# EasyEDA schematic Prática-04.json
TITLE: Sheet_1; REV: 1.0; Date: 2020-09-09; Sheet: 1/1; Company: Your Company
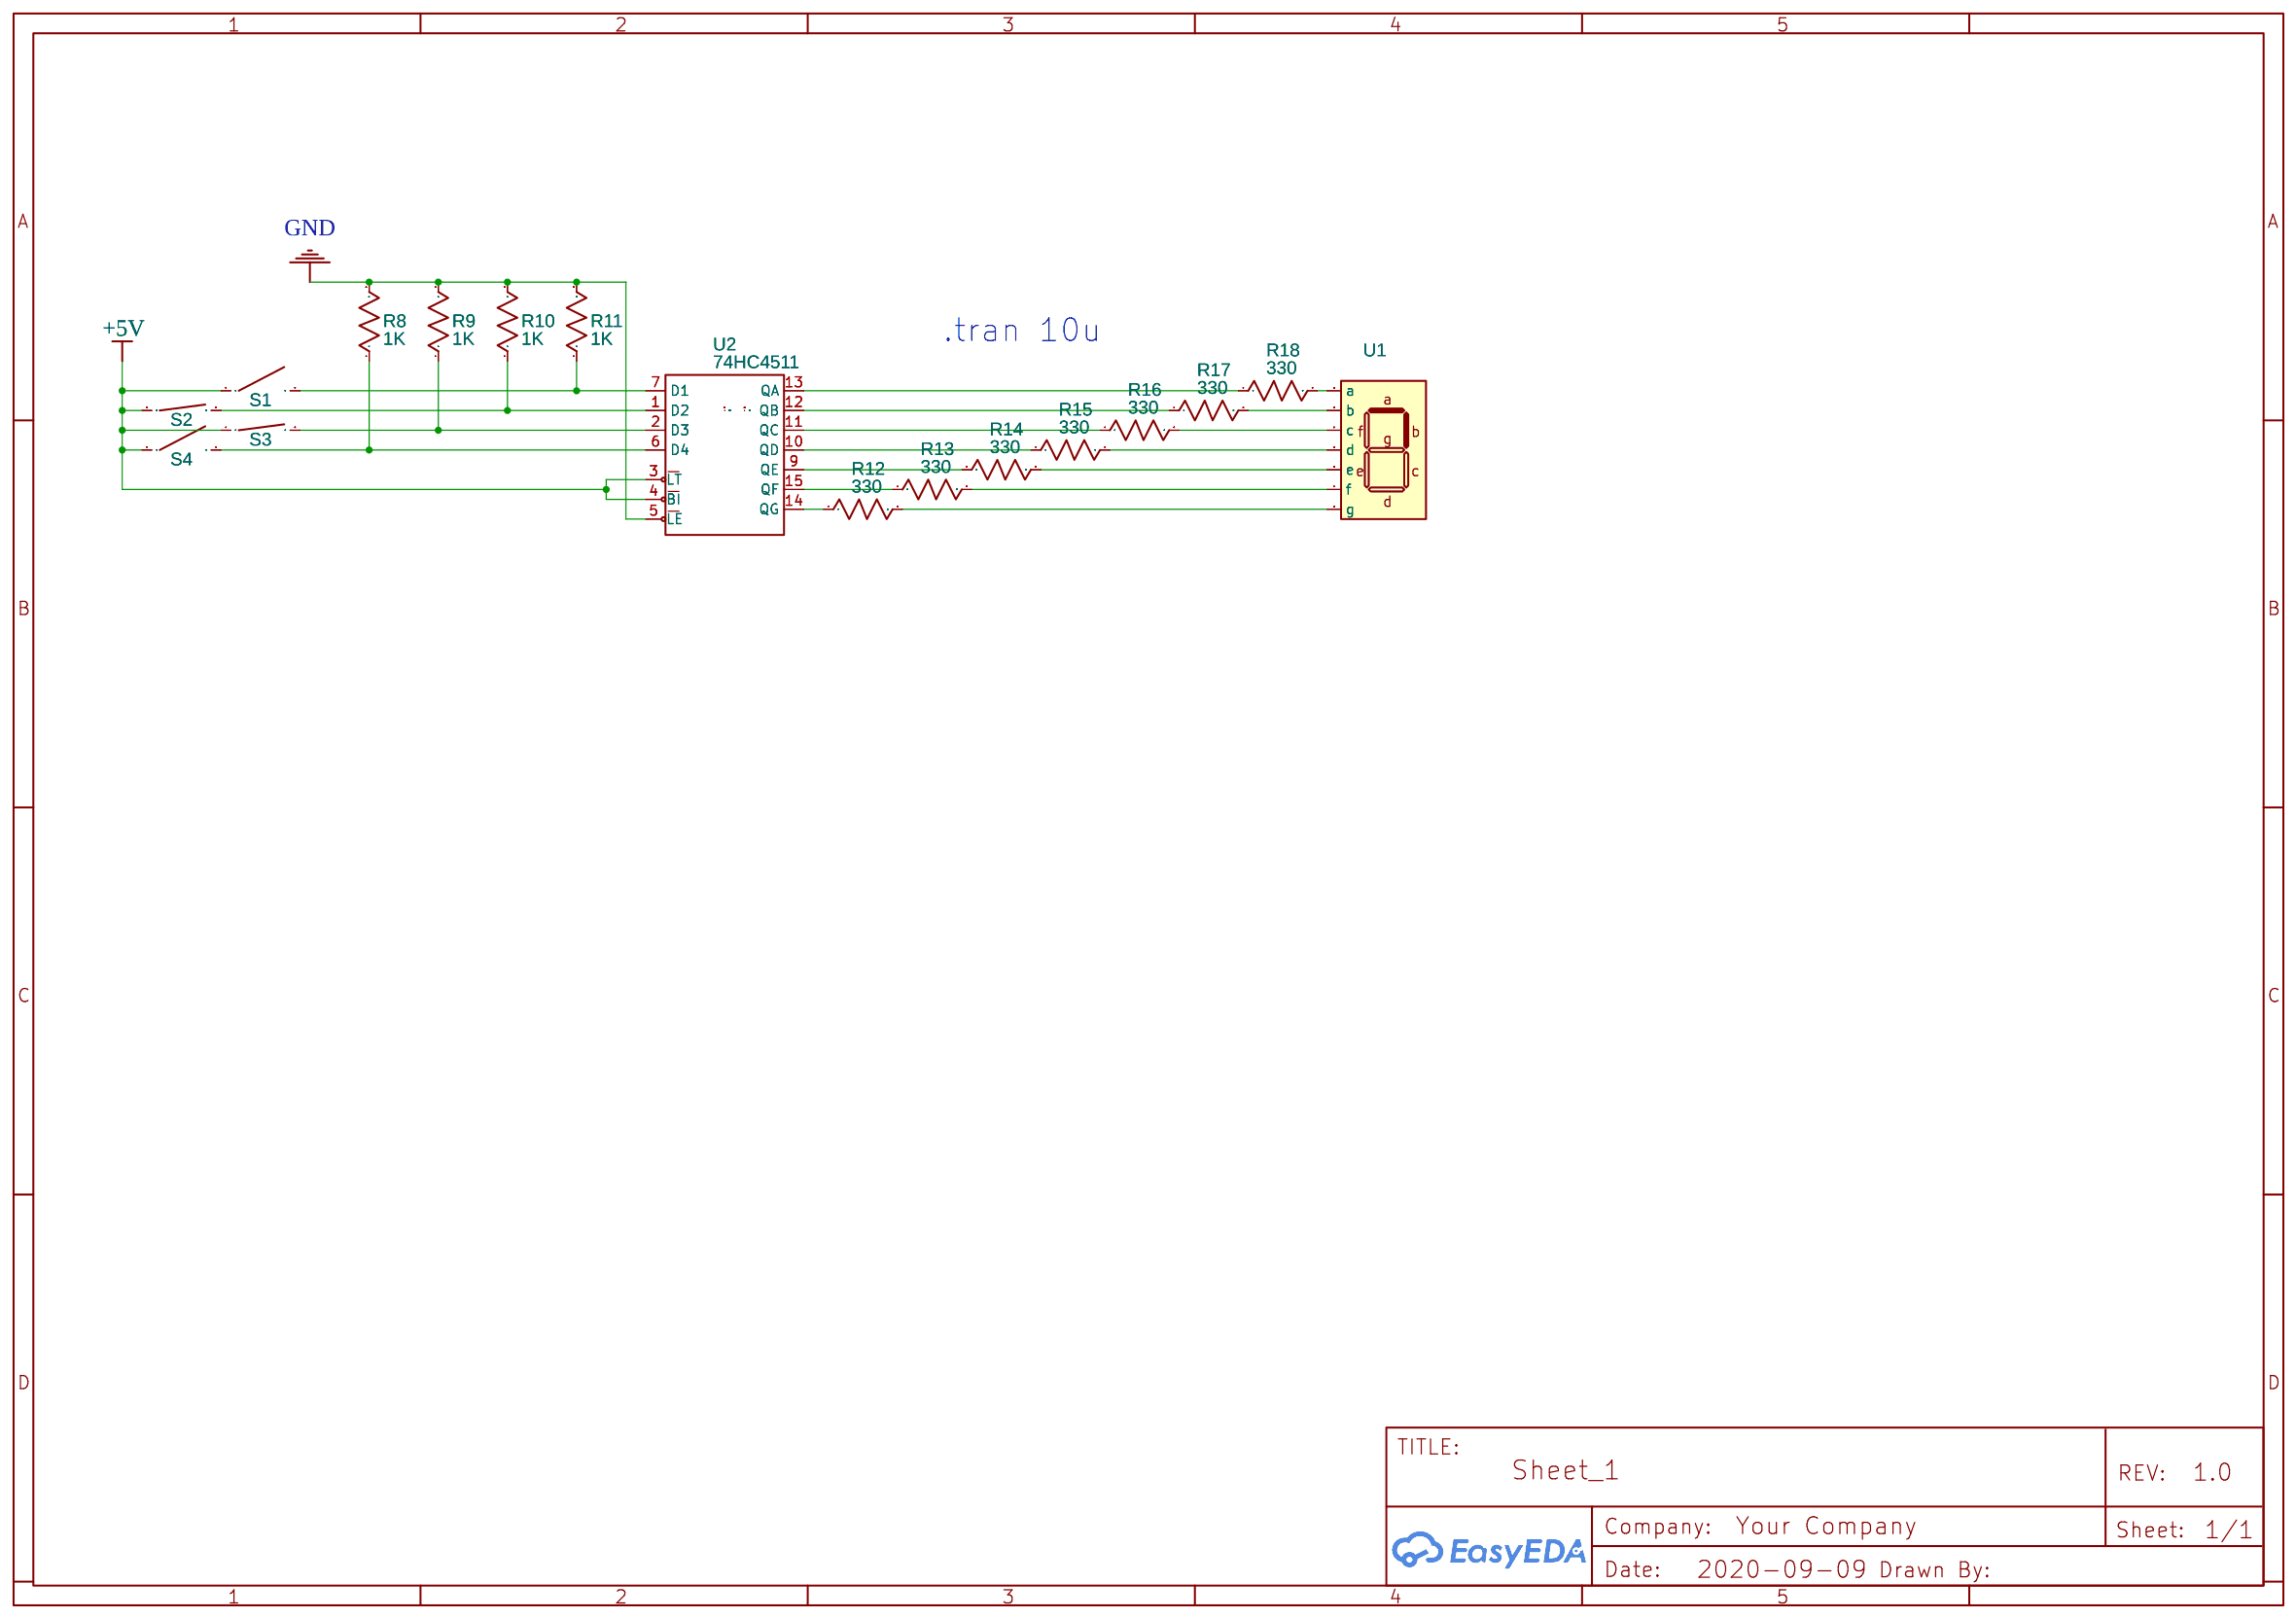
[diagram p0: schematic sheet]

## Parts
R8  1K  [AXIAL-0.3]
R9  1K  [AXIAL-0.3]
R10  1K  [AXIAL-0.3]
R11  1K  [AXIAL-0.3]
R12  330  [AXIAL-0.3]
R13  330  [AXIAL-0.3]
R14  330  [AXIAL-0.3]
R15  330  [AXIAL-0.3]
R16  330  [AXIAL-0.3]
R17  330  [AXIAL-0.3]
R18  330  [AXIAL-0.3]
S1  SPST_Open
S2  SPST_Open
S3  SPST_Open
S4  SPST_Open
U1  Seven_Segment
U2  74HC4511  [SOIC-16_L10.8-W4.5-P1.27-LS6.8-BL]

## Library data of the parts
R8-R18 = Resistor_US: Resistance: 1k; Contributor: EasyEDA; Supplier: YUJING
S1 S4 = SPST: catid: 20; State: Open; Contributor: EasyEDA; NameDisplay: 0
S2 S3 = SPST: catid: 20; State: Close; Contributor: EasyEDA; NameDisplay: 0
U1 = SEVENSEGMENT: catid: 20; Type: Common Cathode; Color: Red; Contributor: EasyEDA; NameDisplay: 0
U2 = DIGITAL: catid: 20; Contributor: 立创EDA官方封装库; sim: true

## Nets
+5V: S1.1 S2.1 S3.1 S4.1 U2.3(LT) U2.4(BI)
GND: R8.2 R9.2 R10.2 R11.2 U2.5(LE)
Net-(R8-1): R8.1 S4.2 U2.6(D4)
Net-(R9-1): R9.1 S3.2 U2.2(D3)
Net-(R10-1): R10.1 S2.2 U2.1(D2)
Net-(R11-1): R11.1 S1.2 U2.7(D1)
Net-(R12-1): R12.1 U2.14(QG)
Net-(R12-2): R12.2 U1.g
Net-(R13-1): R13.1 U2.15(QF)
Net-(R13-2): R13.2 U1.f
Net-(R14-1): R14.1 U2.9(QE)
Net-(R14-2): R14.2 U1.e
Net-(R15-1): R15.1 U2.10(QD)
Net-(R15-2): R15.2 U1.d
Net-(R16-1): R16.1 U2.11(QC)
Net-(R16-2): R16.2 U1.c
Net-(R17-1): R17.1 U2.12(QB)
Net-(R17-2): R17.2 U1.b
Net-(R18-1): R18.1 U2.13(QA)
Net-(R18-2): R18.2 U1.a

Not connected (* = marked no-connect by the designer): U2 8(GND) 16(VCC)

## Notes on the sheet
- .tran 10u
